# Altium schematic sheet cubesat board connector.SchDoc: CubeSat Board Connector
size A4; Date: 2014-12-21; Author: Artur Scholz; DocumentNumber: LibreCube LC23-01a
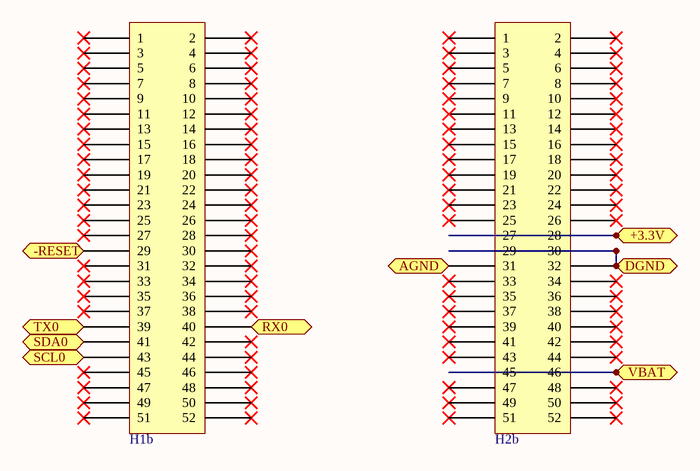
[diagram p0: cubesat board connector.SchDoc]

## Parts
H1b  CSC Header  (value not drawn)
H2b  CSC Header  (value not drawn)

## Ports
+3.3V, -RESET, AGND, DGND, RX0, SCL0, SDA0, TX0, VBAT

## Nets
+3.3V: H2b.27 H2b.28 ; port +3.3V
-RESET: H1b.29 ; port -RESET
AGND: H2b.31 ; port AGND
DGND: H2b.29 H2b.30 H2b.32 ; port DGND
RX0: H1b.40 ; port RX0
SCL0: H1b.43 ; port SCL0
SDA0: H1b.41 ; port SDA0
TX0: H1b.39 ; port TX0
VBAT: H2b.45 H2b.46 ; port VBAT

Not connected (* = marked no-connect by the designer): H1b 1* 2* 3* 4* 5* 6* 7* 8* 9* 10* 11* 12* 13* 14* 15* 16* 17* 18* 19* 20* 21* 22* 23* 24* 25* 26* 27* 28* 30* 31* 32* 33* 34* 35* 36* 37* 38* 42* 44* 45* 46* 47* 48* 49* 50* 51* 52*; H2b 1* 2* 3* 4* 5* 6* 7* 8* 9* 10* 11* 12* 13* 14* 15* 16* 17* 18* 19* 20* 21* 22* 23* 24* 25* 26* 33* 34* 35* 36* 37* 38* 39* 40* 41* 42* 43* 44* 47* 48* 49* 50* 51* 52*

## Library data of the parts
H1b H2b = CubeSat Connector